# Altium schematic sheet Top Sheet_Power System.SchDoc
size B; Organization: Altium Limited; Address1: L3, 12a Rodborough Rd; Address2: Frenchs Forest; Address3: NSW; Address4: Australia 2086; SheetNumber: 1; SheetTotal: 1
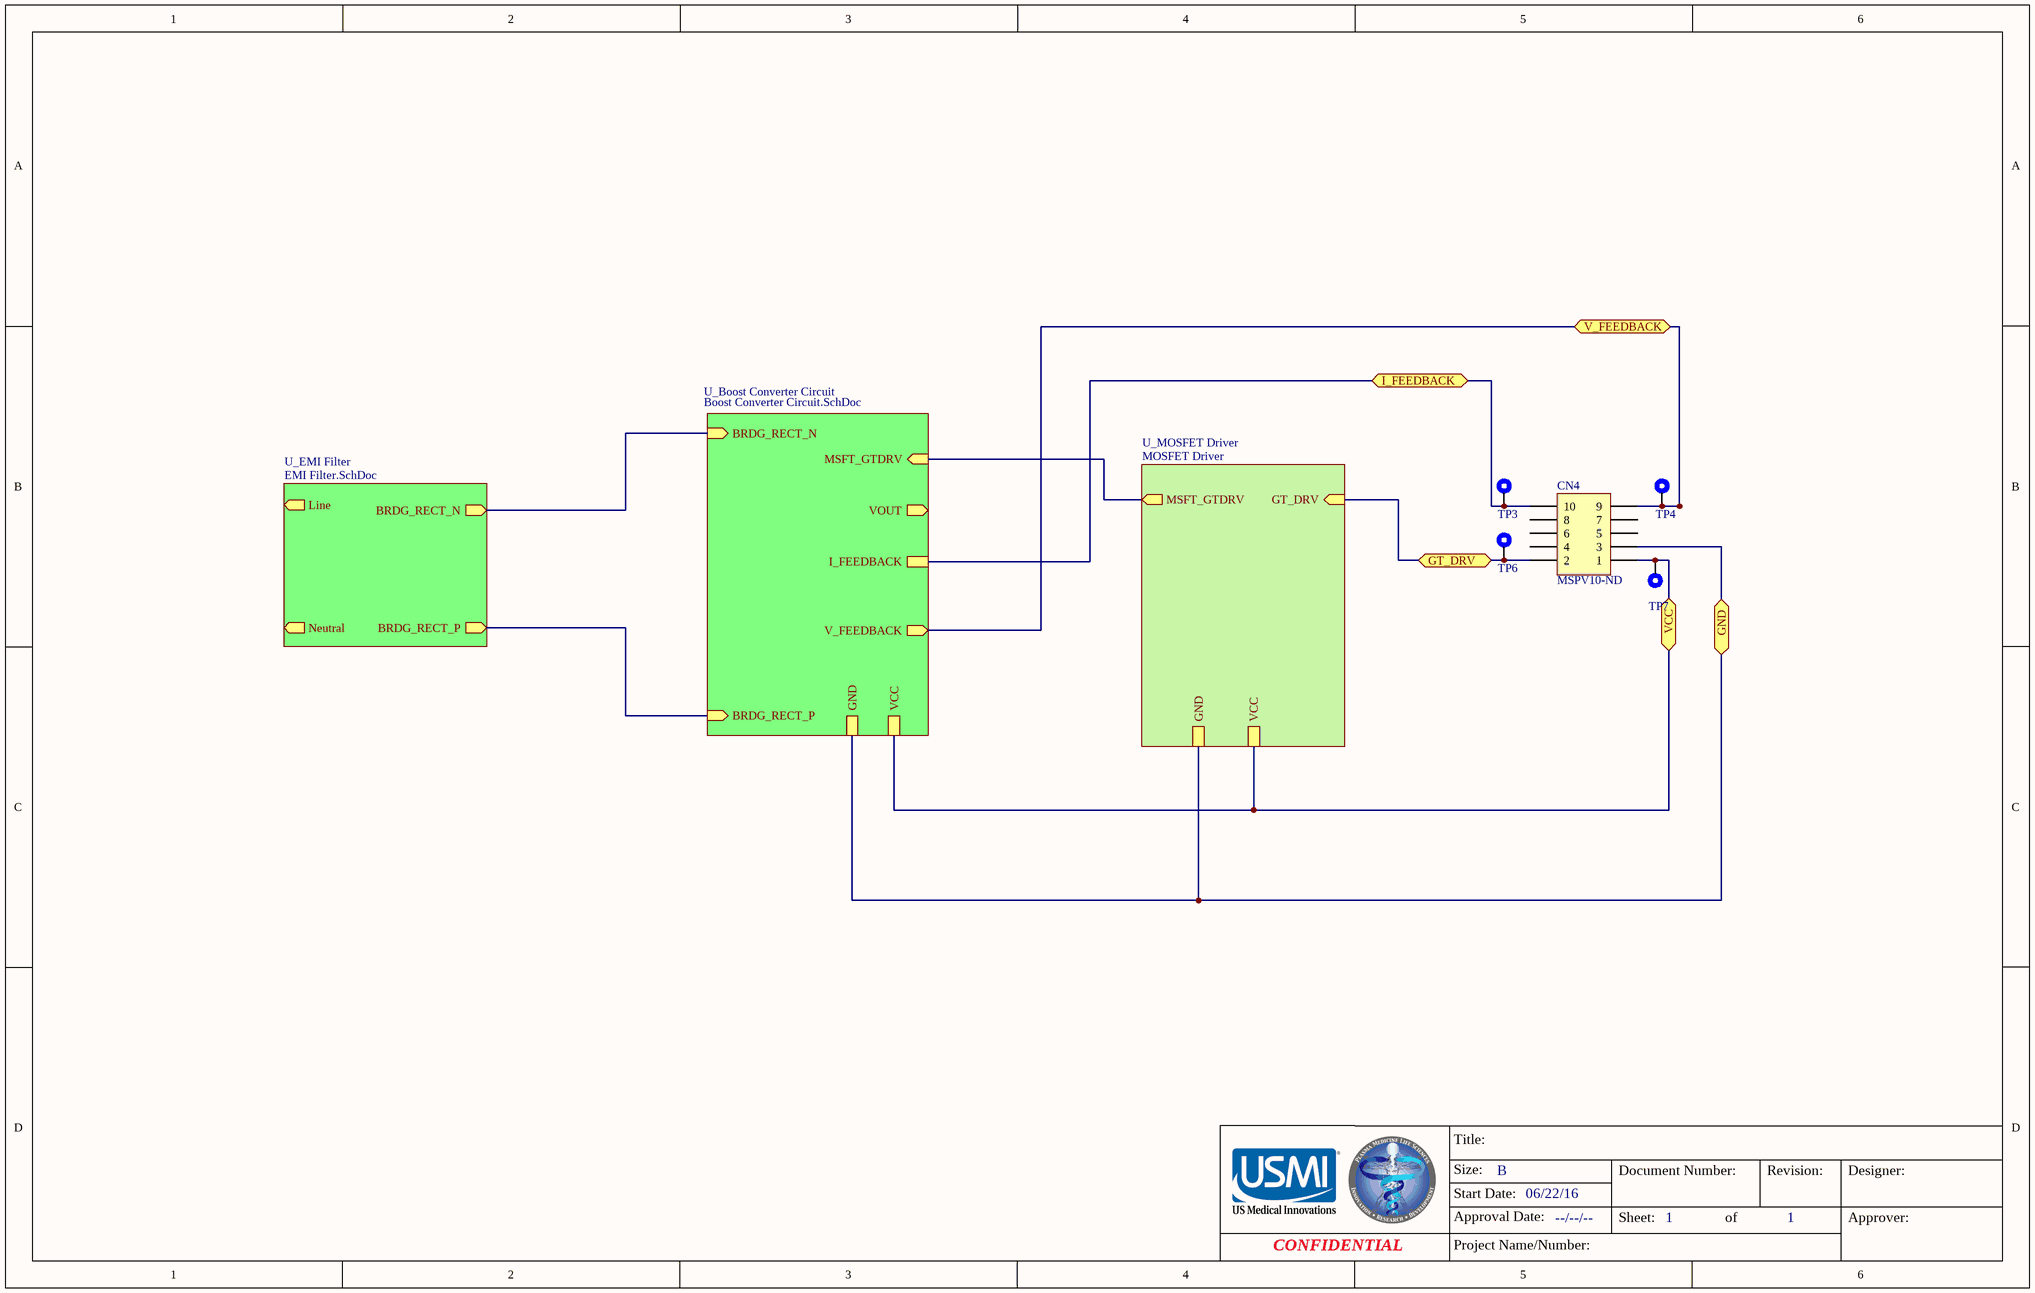
[diagram p0: Top Sheet_Power System.SchDoc]

## Parts
CN4  MSPV10-ND  [MSV10-ND]
TP3  5006  [Test Point]  (value not drawn)
TP4  5006  [Test Point]  (value not drawn)
TP6  5006  [Test Point]  (value not drawn)
TP7  5006  [Test Point]  (value not drawn)

## Sub-sheets
U_Boost Converter Circuit = Boost Converter Circuit.SchDoc: BRDG_RECT_P (in), VOUT (out), MSFT_GTDRV (in), BRDG_RECT_N (in), V_FEEDBACK (out), I_FEEDBACK, VCC, GND
U_EMI Filter = EMI Filter.SchDoc: BRDG_RECT_P (out), BRDG_RECT_N (out), Line (out), Neutral (out)
U_MOSFET Driver = MOSFET Driver: MSFT_GTDRV (out), GT_DRV (in), GND, VCC

## Ports
GND, GT_DRV, I_FEEDBACK, V_FEEDBACK, VCC

## Nets
GND: CN4.3 ; port GND, sheet U_Boost Converter Circuit/GND, sheet U_MOSFET Driver/GND
GT_DRV: CN4.2 TP6.1 ; port GT_DRV, sheet U_MOSFET Driver/GT_DRV
I_FEEDBACK: CN4.10 TP3.1 ; port I_FEEDBACK, sheet U_Boost Converter Circuit/I_FEEDBACK
V_FEEDBACK: CN4.9 TP4.1 ; port V_FEEDBACK, sheet U_Boost Converter Circuit/V_FEEDBACK
VCC: CN4.1 TP7.1 ; port VCC, sheet U_Boost Converter Circuit/VCC, sheet U_MOSFET Driver/VCC
(unnamed): sheet U_EMI Filter/BRDG_RECT_P, sheet U_Boost Converter Circuit/BRDG_RECT_P
(unnamed): sheet U_EMI Filter/BRDG_RECT_N, sheet U_Boost Converter Circuit/BRDG_RECT_N
(unnamed): sheet U_Boost Converter Circuit/MSFT_GTDRV, sheet U_MOSFET Driver/MSFT_GTDRV

Not connected (* = marked no-connect by the designer): CN4 4 5 6 7 8

## Notes on the sheet
- Title:
- Size:
- B
- Document Number:
- Revision:
- Designer:
- Approval Date:
- Start Date:
- 06/22/16
- --/--/--
- Sheet:
- of
- Approver:
- CONFIDENTIAL
- Project Name/Number:

## Library data of the parts
CN4 = MSPV10-ND: CONN SOCKET PCB VERT 10POS .1"; Manufacturer: 3M; Manufacturer Part Number: 8510-4500PL; Connector Type: Receptacle; Style: Board to Board or Cable; Number of Positions: 10; Number of Positions Loaded: All; Pitch - Mating: 0.100" (2.54mm); Contact Length - Post: 0.110" (2.79mm); Material Flammability Rating: UL94 V-0; Current Rating: 1A; Voltage Rating: 1000V; Supplier 1: Digi-Key; RoHS: RoHS Compliant; Category: Connectors, Interconnects; Stock 1: 448; Pricing 1: 1=3.03, 10=2.904, 100=2.42, 500=2.057, 1000=1.7545, 5000=1.573 (USD); Packaging: Bulk; Part Status: Active; Contact Type: Female Socket; Number of Rows: 2; Row Spacing - Mating: 0.100" (2.54mm); Mounting Type: Through Hole; Termination: Kinked Pin, Solder; Fastening Type: Push-Pull; Contact Finish - Mating: Gold; Contact Finish Thickness - Mating: 12µin (0.30µm); Insulation Color: Gray; Insulation Height: 0.425" (10.80mm); Operating Temperature: -55°C ~ 105°C; Contact Finish - Post: Gold; Mated Stacking Heights: -; Ingress Protection: -; Features: Polarizing Key; Applications: -; Insulation Material: Polybutylene Terephthalate (PBT), Glass Filled; Contact Shape: Square; Contact Material: Copper Alloy; Contact Finish Thickness - Post: Flash; ComponentLink1URL: http://multimedia.3m.com/mws/media/22252O/3mtm-100-in-plr-bmskt-100x-100ctrbmp-strt-sldr-tls-ts0413.pdf; ComponentLink1Description: http://multimedia.3m.com/mws/media/22252O/3mtm-100-in-plr-bmskt-100x-100ctrbmp-strt-sldr-tls-ts0413.pdf; Supplier Part Number 1: MSPV10-ND
TP3 TP4 TP6 TP7 = 5006: TEST POINT PC COMPACT .063"D BLK; Manufacturer 1: Keystone Electronics; Category 1: Test and Measurement; Plating: Silver; Material - Insulation: Nylon 46, UL 94V-0; Material - Body: Phosphor Bronze; Supplier 1: Digi-Key; Supplier Part Number 1: 36-5006-ND; Manufacturer Part Number 1: 5006; RoHS 1: RoHS Compliant; Description 1: TEST POINT PC COMPACT .063"D BLK; Stock 1: 199444; Pricing 1: 1=0.37, 10=0.316, 50=0.2298, 100=0.2209, 250=0.19832, 500=0.18932, 1000=0.1616, 2500=0.14424, 5000=0.13523 (USD); Packaging: Bulk; Part Status: Active; Type: PC Test Point, Compact; Mounting Type: 0.063" (1.60mm) Hole Diameter; Color: Black; Size / Dimension: 0.125" Dia x 0.220" L (3.18mm x 5.59mm); ComponentLink1URL: http://www.keyelco.com/product-pdf.cfm?p=1314; ComponentLink1Description: http://www.keyelco.com/product-pdf.cfm?p=1314